# EasyEDA Pro project ProPrj_baqu_PCB_kyubeom_2026-08-27.epro

# Schematic Schematic1

## Sheets
1 Power, Connector: Board Name: Board1; Create Date: 2026-07-14; Page Name: P1; Project Name: baqu_PCB_kyubeom; Schematic Name: Schematic1; Update Date: 2026-07-14; Company: EasyEDA.com; Page Size: A4; Version: V1.0
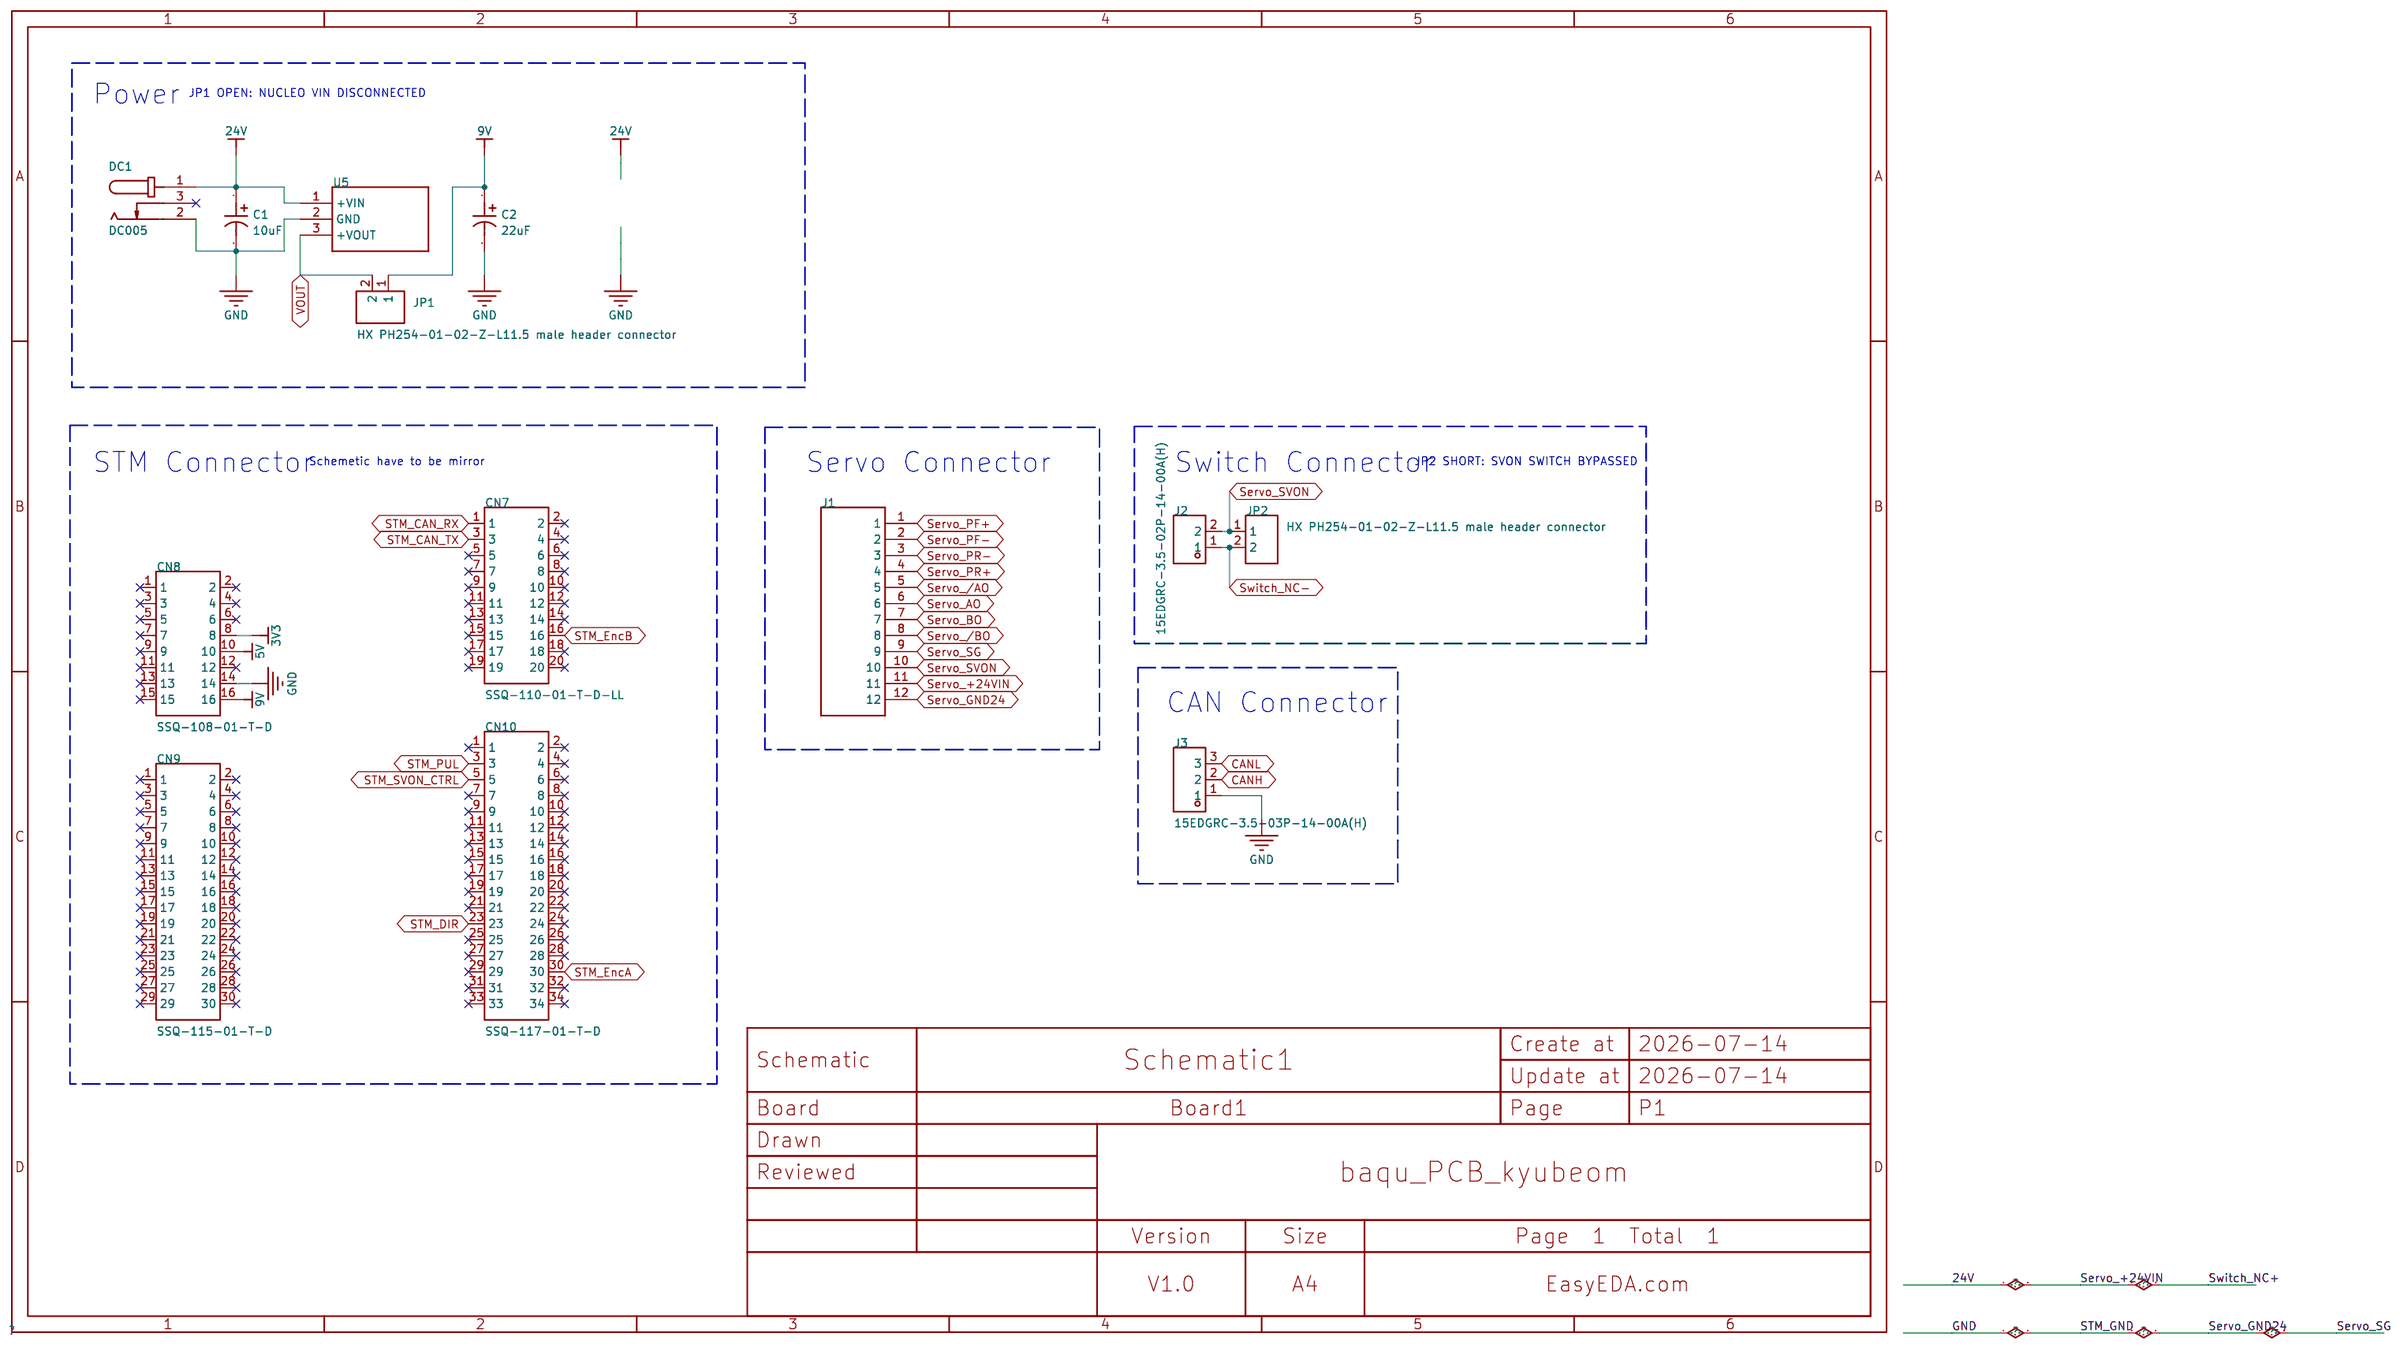
[diagram p0: Power, Connector]
2 IC: Create Date: 2026-08-25; Page Name: P3; Update Date: 2026-08-25
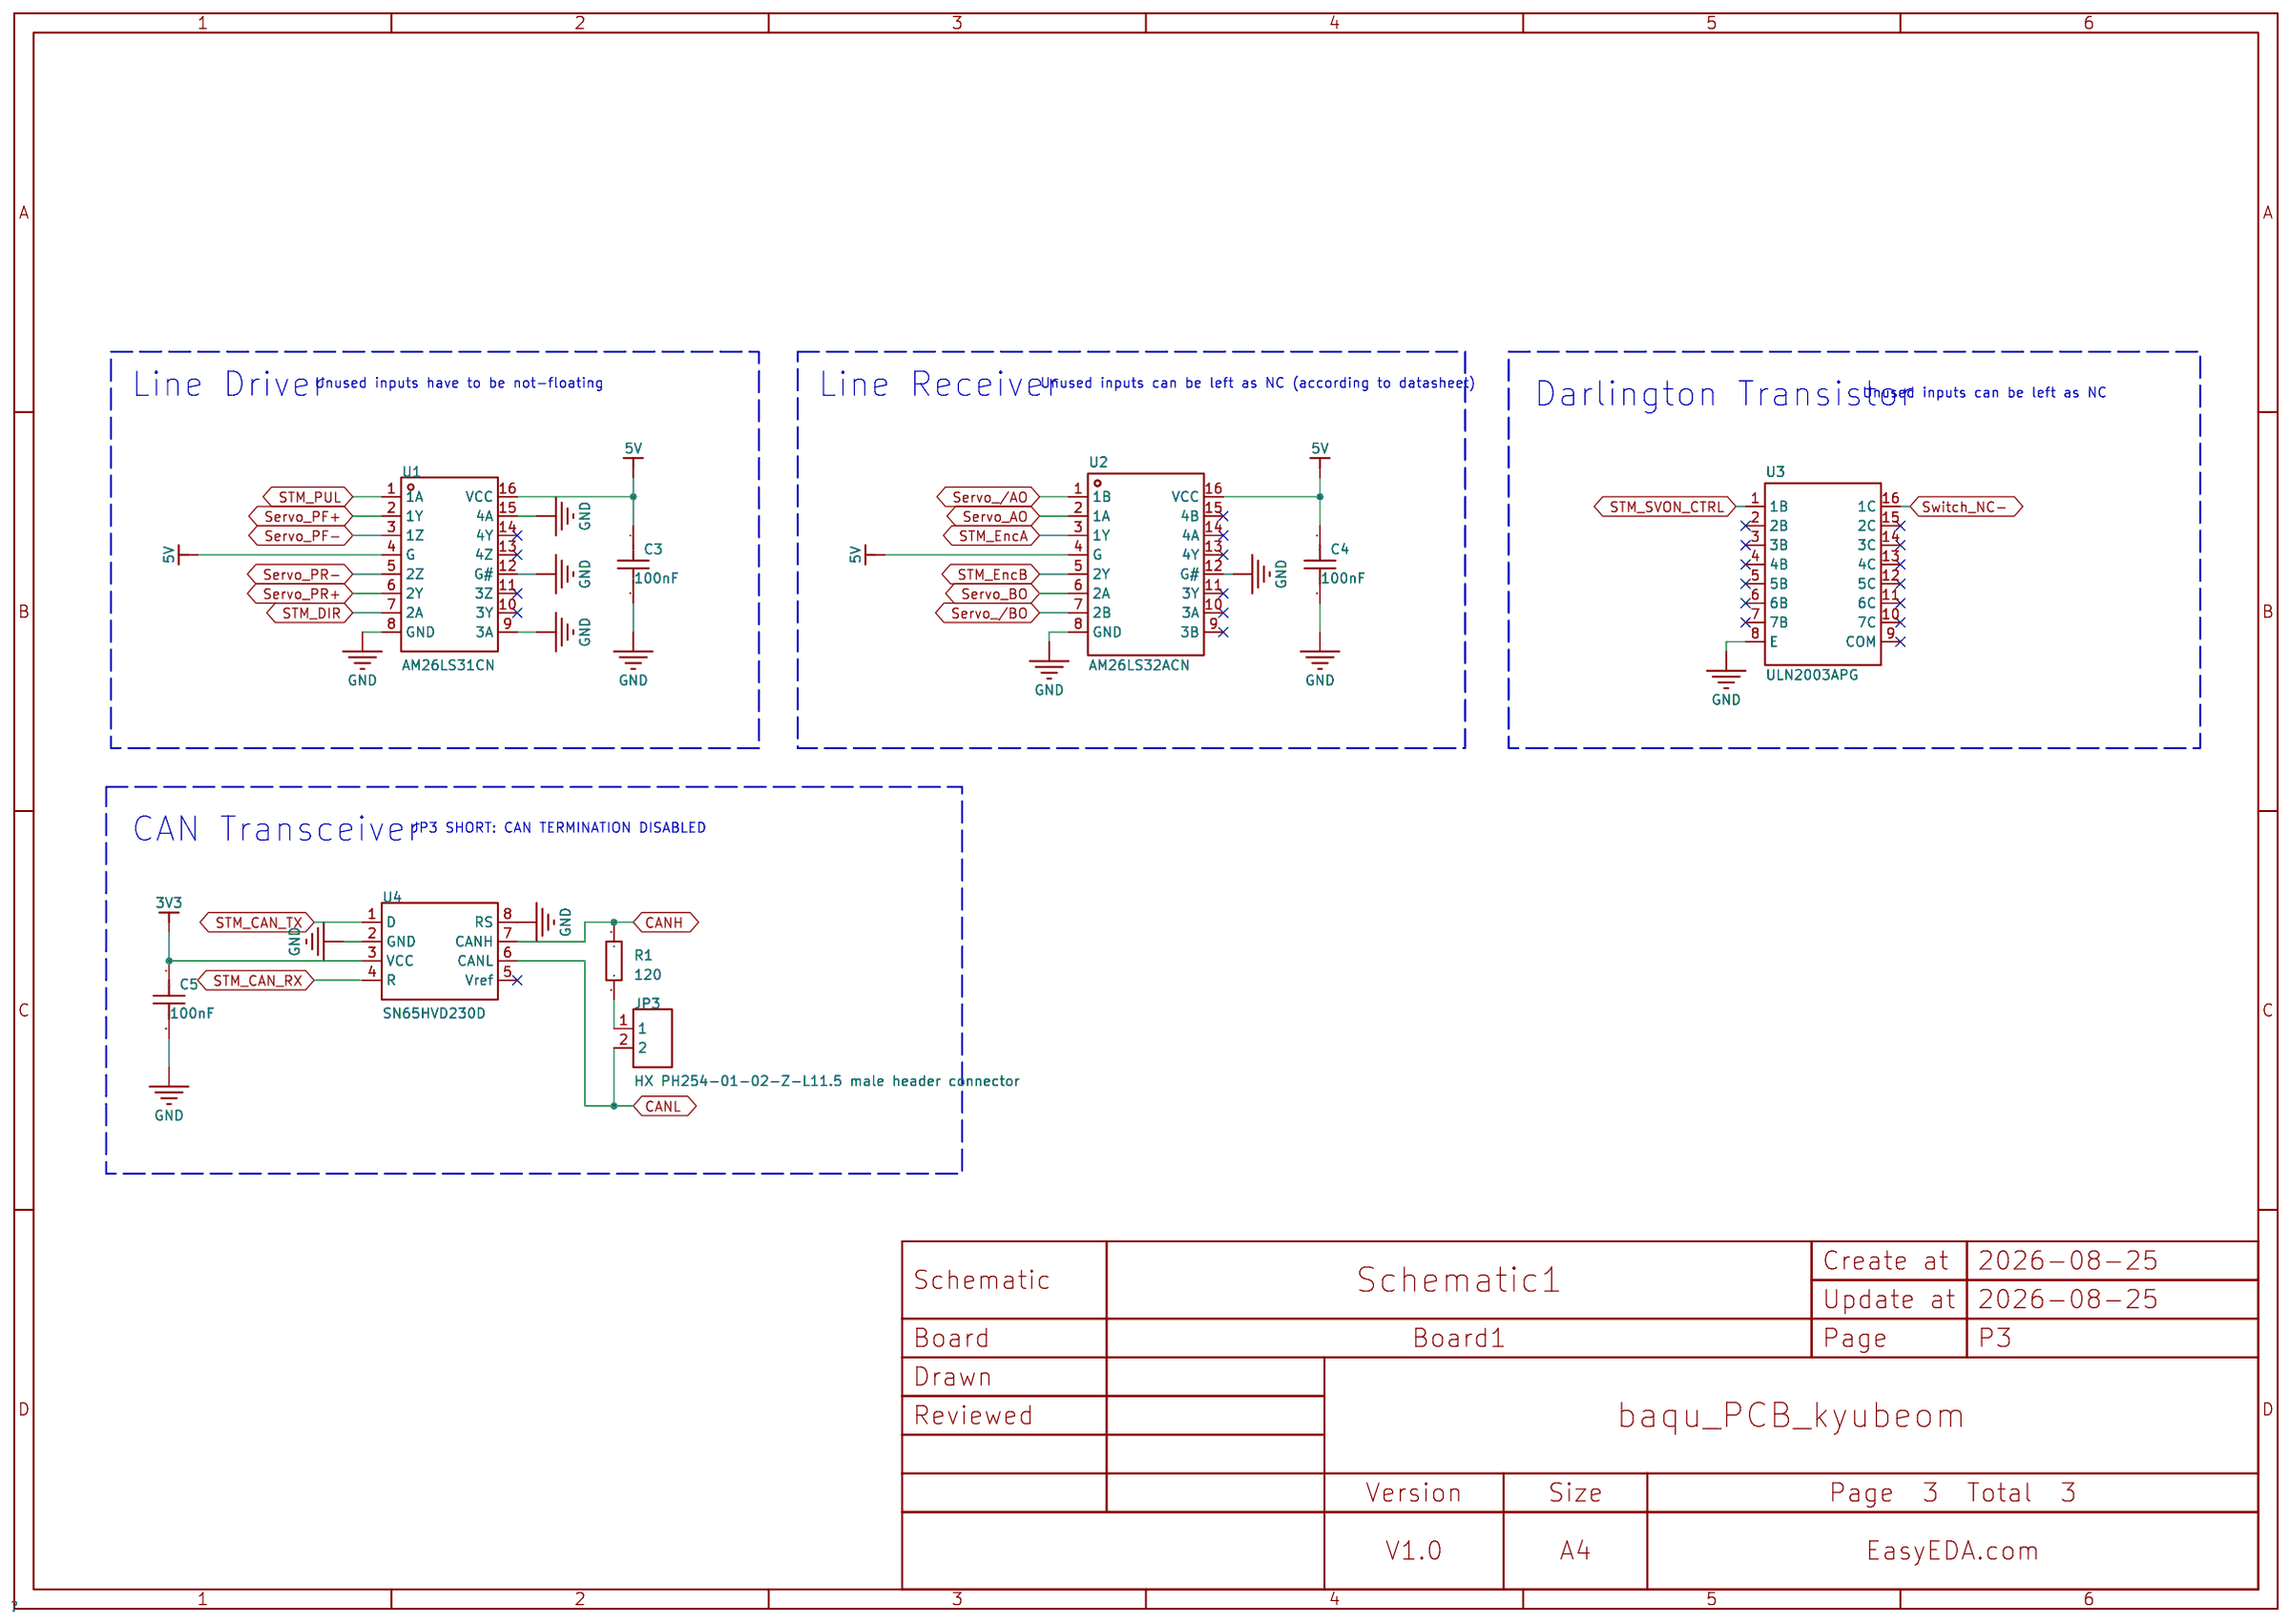
[diagram p1: IC]

## Parts
sheet IC
C3  100nF  [C0805]
C4  100nF  [C0805]
C5  100nF  [C0805]
JP3  HX PH254-01-02-Z-L11.5 male header connector  [HDR-TH_2P-P2.54-V-M]
R1  120  [R0805]
U1  AM26LS31CN  [DIP-16_L20.4-W5.8-P2.54-LS7.6-BL]
U2  AM26LS32ACN  [DIP-16_L20.0-W6.4-P2.54-LS7.6-BL]
U3  ULN2003APG  [DIP-16_L19.2-W6.6-P2.54-LS7.6-BL]
U4  SN65HVD230D  [SOIC-8_L4.9-W3.9-P1.27-LS6.0-BL]
sheet Power, Connector
C1  10uF  [CAP-TH_BD5.0-P2.00-D0.5-FD]
C2  22uF  [CAP-TH_BD5.0-P2.00-D0.5-FD]
CN7  SSQ-110-01-T-D-LL  [CONN-TH_SSQ-110-03-G-D]
CN8  SSQ-108-01-T-D  [HDR-TH_16P-P2.54_SSQ-108-01-G-D]
CN9  SSQ-115-01-T-D  [HDR-TH_30P-P2.54_SSQ-115-03-G-D]
CN10  SSQ-117-01-T-D  [HDR-TH_34P-P2.54_SSQ-117-01-T-D]
DC1  DC005  [DC-IN-TH_DC005]
J1  -  [530481210]
J2  15EDGRC-3.5-02P-14-00A(H)  [CONN-TH_2P-P3.50_DEGSON_15EDGRC-3.5-02P-14-00A]
J3  15EDGRC-3.5-03P-14-00A(H)  [CONN-TH_3P-P3.50_15EDGRC-3.5-03P]
JP1  HX PH254-01-02-Z-L11.5 male header connector  [HDR-TH_2P-P2.54-V-M]
JP2  HX PH254-01-02-Z-L11.5 male header connector  [HDR-TH_2P-P2.54-V-M]
U5  -  [N78091C]

## Library data of the parts
C3-C5 = CAP_0805: Supplier Footprint: 0805
JP1-JP3 = HX PH254-01-02-Z-L11.5 male header connector: Pin Structure:1x2P Pitch:2.54mm Circluar Pins/Square Pins:Pin Header Mounting Type:Through Hole Number of Rows:1 Number of Pins:2P Current Rating:3A Voltage Rating (Max):1kV Length of Mating Pin:6mm Insulation Height:2.5mm Length of End Connection Pin:3mm; LCSC Part Name: 1x2P 间距:2.54mm 方针 直插; Supplier Part: C52016390; Manufacturer: hanxia(韩下); Supplier Footprint: 插件,P=2.54mm; JLCPCB Part Class: Extended Part; Datasheet: https://item.szlcsc.com/datasheet/HX%2520PH254-01-02-Z-L11.5%2520male%2520header%2520connector/54760435.html; Supplier: LCSC; Pin Structure: 1x2P; Pitch: 2.54mm; Circluar Pins/Square Pins: Pin Header; Mounting Type: Through Hole; Number of Rows: 1; Number of Pins: 2P; Current Rating: 3A; Voltage Rating (Max): 1kV; Length of Mating Pin: 6mm; Insulation Height: 2.5mm; Length of End Connection Pin: 3mm; Contact Material: Brass; Contact Plating: Gold; Operating Temperature: -40℃~+105℃
R1 = Res_0805: Supplier Footprint: 0805
U1 = AM26LS31CN: Type:Driver Number of Drivers:4 Number of Receivers:0 Voltage - Supply:4.75V~5.25V Voltage - Supply:4.75V~5.25V ESD Protect:±2kV ESD Protect:±2kV Operating Temperature:0℃~+70℃ Operating Temperature:0℃~+70℃ Quiescent Supply Current:80mA Features:Enable shu; LCSC Part Name: AM26LS31x 四重差分线驱动器; Supplier Part: C29911; Manufacturer: TI(德州仪器); Supplier Footprint: DIP-16; JLCPCB Part Class: Extended Part; Datasheet: https://www.ti.com/cn/lit/ds/symlink/am26ls31.pdf; Supplier: LCSC; Type: Driver; Number of Drivers: 4; Number of Receivers: 0; Voltage - Supply: 4.75V~5.25V; ESD Protect: ±2kV; Operating Temperature: 0℃~+70℃; Quiescent Supply Current: 80mA; Features: Enable shutdown；Overcurrent Protection
U2 = AM26LS32ACN: Type:Receiver Number of Drivers:0 Number of Receivers:4 Voltage - Supply:4.75V~5.25V Voltage - Supply:4.75V~5.25V Data Rate:- Data Rate:- Number of Nodes:- ESD Protect:- ESD Protect:- Operating Temperature:0℃~+70℃ Operating Temperature:0℃~+70℃ Quiescent S; LCSC Part Name: 四路差分线接收器; Supplier Part: C29912; Manufacturer: TI(德州仪器); Supplier Footprint: DIP-16; JLCPCB Part Class: Extended Part; Datasheet: https://www.ti.com/cn/lit/gpn/am26ls32ac; Supplier: LCSC; Type: Receiver; Number of Drivers: 0; Number of Receivers: 4; Voltage - Supply: 4.75V~5.25V; Operating Temperature: 0℃~+70℃; Quiescent Supply Current: 52mA
U3 = ULN2003APG: number of channels:Seven channels Collector - Emitter Voltage VCEO:- Current - Collector(Ic):500mA Voltage - Input(Max):30V Operating Temperature:- Operating Temperature:- Output Leakage Current(Icex):50uA Vce Saturation(VCE(sat)):1.6V Input Current(on):0; LCSC Part Name: 停产 ULN2003APG; Supplier Part: C5251; Manufacturer: TOSHIBA(东芝); Supplier Footprint: DIP-16; JLCPCB Part Class: Extended Part; Datasheet: https://item.szlcsc.com/datasheet/ULN2003APG/5672.html; Supplier: LCSC; number of channels: Seven channels; Current - Collector(Ic): 500mA; Voltage - Input(Max): 30V; Output Leakage Current(Icex): 50uA; Vce Saturation(VCE(sat)): 1.6V; Input Current(on): 0.4mA; Voltage - Forward(Vf): 2V; Reverse Leakage Current (Ir): 50uA; Input Capacitiance(Ci): 15pF; Type: BJT
U4 = SN65HVD230D: Type:CAN Transceiver Data Rate:1Mbps Voltage - Supply:3V~3.6V Voltage - Supply:3V~3.6V Current - Supply:17mA Operating Temperature:-40℃~+85℃ Operating Temperature:-40℃~+85℃ Number of Channels:1 Quiescent Supply Current:370uA Features:Wake-up function；Hot-; LCSC Part Name: SN65HVD230, SN65HVD231, SN65HVD232 3.3V CAN总线收发器 停产; Supplier Part: C1543812; Manufacturer: TI(德州仪器); Supplier Footprint: SOIC-8; JLCPCB Part Class: Extended Part; Datasheet: https://www.ti.com/cn/lit/ds/symlink/sn65hvd230.pdf; Supplier: LCSC; Type: CAN Transceiver; Data Rate: 1Mbps; Voltage - Supply: 3V~3.6V; Current - Supply: 17mA; Operating Temperature: -40℃~+85℃; Number of Channels: 1; Quiescent Supply Current: 370uA; Features: Wake-up function；Hot-swap protection；Thermal shutdown protection；ESD protection；Low-power mode；Bus fault protection
C1 C2 = 50V10uF CD288: Capacitance:10uF Tolerance:±20% Tolerance:±20% Voltage Rating:50V Pin Spacing:2mm Diameter:5mm Height - Seated (Max):11mm Operating Temperature:-40℃~+105℃ Operating Temperature:-40℃~+105℃; LCSC Part Name: 10uF ±20% 50V; Supplier Part: C2960372; Manufacturer: HRK(鸿瑞凯电子); Supplier Footprint: 插件,D5xL11mm; JLCPCB Part Class: Extended Part; Supplier: LCSC; Tolerance: ±20%; Voltage Rating: 50V; Pin Spacing: 2mm; Diameter: 5mm; Height - Seated (Max): 11mm; Operating Temperature: -40℃~+105℃
CN7 = SSQ-110-01-T-D-LL: Pitch:2.54mm Row Spacing:2.54mm Mounting Type:Through Hole Number of Rows:2 Number of Positions:20P Voltage Rating (Max):- Insulation Height:8.51mm Contact Plating:Tin Operating Temperature:-55℃~+105℃ Operating Temperature:-55℃~+105℃; LCSC Part Name: 间距:2.54mm 直插; Supplier Part: C5930738; Manufacturer: SAMTEC; Supplier Footprint: 插件,P=2.54mm; JLCPCB Part Class: Extended Part; Datasheet: https://item.szlcsc.com/datasheet/SSQ-110-01-T-D-LL/6868091.html; Supplier: LCSC; Pitch: 2.54mm; Row Spacing: 2.54mm; Mounting Type: Through Hole; Number of Rows: 2; Number of Positions: 20P; Insulation Height: 8.51mm; Contact Plating: Tin; Operating Temperature: -55℃~+105℃
CN8 = SSQ-108-01-T-D: Pitch:2.54mm Row Spacing:2.54mm Mounting Type:Through Hole Number of Rows:2 Number of Positions:16P Voltage Rating (Max):- Insulation Height:8.51mm Contact Plating:Tin Operating Temperature:-55℃~+105℃ Operating Temperature:-55℃~+105℃; LCSC Part Name: 间距:2.54mm 直插; Supplier Part: C5930694; Manufacturer: SAMTEC; Supplier Footprint: 插件,P=2.54mm; JLCPCB Part Class: Extended Part; Datasheet: https://item.szlcsc.com/datasheet/SSQ-108-01-T-D/6868047.html; Supplier: LCSC; Pitch: 2.54mm; Row Spacing: 2.54mm; Mounting Type: Through Hole; Number of Rows: 2; Number of Positions: 16P; Insulation Height: 8.51mm; Contact Plating: Tin; Operating Temperature: -55℃~+105℃
CN9 = SSQ-115-01-T-D: Pitch:2.54mm Row Spacing:2.54mm Mounting Type:Through Hole Number of Rows:2 Number of Positions:30P Voltage Rating (Max):- Insulation Height:8.51mm Contact Plating:Tin Operating Temperature:-55℃~+105℃ Operating Temperature:-55℃~+105℃; LCSC Part Name: 间距:2.54mm 直插; Supplier Part: C6496536; Manufacturer: SAMTEC; Supplier Footprint: 插件,P=2.54mm; JLCPCB Part Class: Extended Part; Datasheet: https://item.szlcsc.com/datasheet/SSQ-115-01-T-D/7449721.html; Supplier: LCSC; Pitch: 2.54mm; Row Spacing: 2.54mm; Mounting Type: Through Hole; Number of Rows: 2; Number of Positions: 30P; Insulation Height: 8.51mm; Contact Plating: Tin; Operating Temperature: -55℃~+105℃
CN10 = SSQ-117-01-T-D: Pitch:2.54mm Row Spacing:2.54mm Circular Hole / Square Hole:Square Hole Mounting Type:Through Hole Number of Rows:2 Number of Positions:34P Current Rating:4.7A Voltage Rating (Max):655V Holes Direction:Top Insulation Height:8.51mm Contact Plating:Tin Oper; LCSC Part Name: 间距:2.54mm 直插; Supplier Part: C5760723; Manufacturer: SAMTEC; Supplier Footprint: 插件,P=2.54mm; JLCPCB Part Class: Extended Part; Datasheet: https://item.szlcsc.com/datasheet/SSQ-117-01-T-D/6687000.html; Supplier: LCSC; Pitch: 2.54mm; Row Spacing: 2.54mm; Circular Hole / Square Hole: Square Hole; Mounting Type: Through Hole; Number of Rows: 2; Number of Positions: 34P; Current Rating: 4.7A; Voltage Rating (Max): 655V; Holes Direction: Top; Insulation Height: 8.51mm; Contact Plating: Tin; Operating Temperature: -55℃~+105℃
DC1 = DC005: Connector Type:DC Power Jack Mounting Type:Right Angle Inside Contact Diameter:2mm Outside Contact Diameter:6.3mm Current Rating:500mA Voltage Rating (Max):12V Operating Temperature:-30℃~+70℃ Operating Temperature:-30℃~+70℃; LCSC Part Name: DC005-2.0 黑（铁）; Supplier Part: C431533; Manufacturer: SHOU HAN(首韩); Supplier Footprint: 插件; JLCPCB Part Class: Extended Part; Datasheet: https://item.szlcsc.com/datasheet/DC005/427890.html; Supplier: LCSC; Connector Type: DC Power Jack; Mounting Type: Right Angle; Inside Contact Diameter: 2mm; Outside Contact Diameter: 6.3mm; Current Rating: 500mA; Voltage Rating (Max): 12V; Operating Temperature: -30℃~+70℃
J1 = 53048-1210
J2 = 15EDGRC-3.5-02P-14-00A(H): Connector Type:Board Side/Socket - Closed Termination Style:Hinged (Snap On) Number of Positions or Pins:1x2P Pitch:3.5mm Color:Green Mounting Type:Right-Angle Number of Pins:2P Number of Rows:1 Number of PINs Per Row:2 Current Rating:7A Voltage Rating (M; LCSC Part Name: 卡扣固定 1x2P 3.5mm 排数:1 每排P数:2; Supplier Part: C5160225; Manufacturer: DEGSON(高正/高松); Supplier Footprint: 插件,P=3.5mm; JLCPCB Part Class: Extended Part; Datasheet: https://item.szlcsc.com/datasheet/15EDGRC-3.5-02P-14-00A(H)/5805069.html; Supplier: LCSC; Connector Type: Board Side/Socket - Closed; Termination Style: Hinged (Snap On); Number of Positions or Pins: 1x2P; Pitch: 3.5mm; Color: Green; Mounting Type: Right-Angle; Number of Pins: 2P; Number of Rows: 1; Number of PINs Per Row: 2; Current Rating: 7A; Voltage Rating (Max): 250V; Operating Temperature: -40℃~+105℃
J3 = 15EDGRC-3.5-03P-14-00A(H): Connector Type:Board Side/Socket - Closed Number of Positions or Pins:1x3P Pitch:3.5mm Color:Green Mounting Type:Right-Angle Number of Pins:3P Number of Rows:1 Number of PINs Per Row:3 Current Rating:7A Voltage Rating (Max):250V Operating Temperature:-40℃; LCSC Part Name: 1x3P 3.5mm 排数:1 每排P数:3; Supplier Part: C5160226; Manufacturer: DEGSON(高正/高松); Supplier Footprint: 插件,P=3.5mm; JLCPCB Part Class: Extended Part; Datasheet: https://item.szlcsc.com/datasheet/15EDGRC-3.5-03P-14-00A(H)/5805070.html; Supplier: LCSC; Connector Type: Board Side/Socket - Closed; Number of Positions or Pins: 1x3P; Pitch: 3.5mm; Color: Green; Mounting Type: Right-Angle; Number of Pins: 3P; Number of Rows: 1; Number of PINs Per Row: 3; Current Rating: 7A; Voltage Rating (Max): 250V; Operating Temperature: -40℃~+105℃
U5 = N7809-1C

## Nets
3V3: C5.1 CN8.8 U4.3(VCC)
5V: C3.1 C4.1 CN8.10 U1.4(G) U1.16(VCC) U2.4(G) U2.16(VCC)
9V: C2.1 CN8.16 JP1.1
24V: C1.1 DC1.1 J1.11 U5.1(+VIN)
GND: C1.2 C2.2 C3.2 C4.2 C5.2 CN8.14 DC1.2 J1.9 J1.12 J3.1 U1.8(GND) U1.9(3A) U1.12(G#) U1.15(4A) U2.8(GND) U2.12(G#) U3.8(E) U4.2(GND) U4.8(RS) U5.2(GND)
CANH: J3.2 R1.1 U4.7(CANH)
CANL: J3.3 JP3.2 U4.6(CANL)
Servo_/AO: J1.5 U2.1(1B)
Servo_/BO: J1.8 U2.7(2B)
Servo_AO: J1.6 U2.2(1A)
Servo_BO: J1.7 U2.6(2A)
Servo_PF+: J1.1 U1.2(1Y)
Servo_PF-: J1.2 U1.3(1Z)
Servo_PR+: J1.4 U1.6(2Y)
Servo_PR-: J1.3 U1.5(2Z)
Servo_SVON: J1.10 J2.2 JP2.1
STM_CAN_RX: CN7.1 U4.4(R)
STM_CAN_TX: CN7.3 U4.1(D)
STM_DIR: CN10.23 U1.7(2A)
STM_EncA: CN10.30 U2.3(1Y)
STM_EncB: CN7.16 U2.5(2Y)
STM_PUL: CN10.3 U1.1(1A)
STM_SVON_CTRL: CN10.5 U3.1(1B)
Switch_NC-: J2.1 JP2.2 U3.16(1C)
VOUT: JP1.2 U5.3(+VOUT)
$4N50: JP3.1 R1.2

Not connected (* = marked no-connect by the designer): CN7 2* 4* 5* 6* 7* 8* 9* 10* 11* 12* 13* 14* 15* 17* 18* 19* 20*; CN8 1* 2* 3* 4* 5* 6* 7* 9* 11* 12* 13* 15*; CN9 1* 2* 3* 4* 5* 6* 7* 8* 9* 10* 11* 12* 13* 14* 15* 16* 17* 18* 19* 20* 21* 22* 23* 24* 25* 26* 27* 28* 29* 30*; CN10 1* 2* 4* 6* 7* 8* 9* 10* 11* 12* 13* 14* 15* 16* 17* 18* 19* 20* 21* 22* 24* 25* 26* 27* 28* 29* 31* 32* 33* 34*; DC1 3*; U1 10(3Y)* 11(3Z)* 13(4Z)* 14(4Y)*; U2 9(3B)* 10(3A)* 11(3Y)* 13(4Y)* 14(4A)* 15(4B)*; U3 2(2B)* 3(3B)* 4(4B)* 5(5B)* 6(6B)* 7(7B)* 9(COM)* 10(7C)* 11(6C)* 12(5C)* 13(4C)* 14(3C)* 15(2C)*; U4 5(Vref)*

## Notes on the sheets
sheet 1
- Power
- JP1 OPEN: NUCLEO VIN DISCONNECTED
- Schemetic have to be mirror
- JP2 SHORT: SVON SWITCH BYPASSED
- STM Connector
- Servo Connector
- Switch Connector
- CAN Connector
sheet 2
- Line Driver
- Unused inputs have to be not-floating
- Line Receiver
- Unused inputs can be left as NC (according to datasheet)
- Darlington Transistor
- Unused inputs can be left as NC
- CAN Transceiver
- JP3 SHORT: CAN TERMINATION DISABLED

# Board PCB1
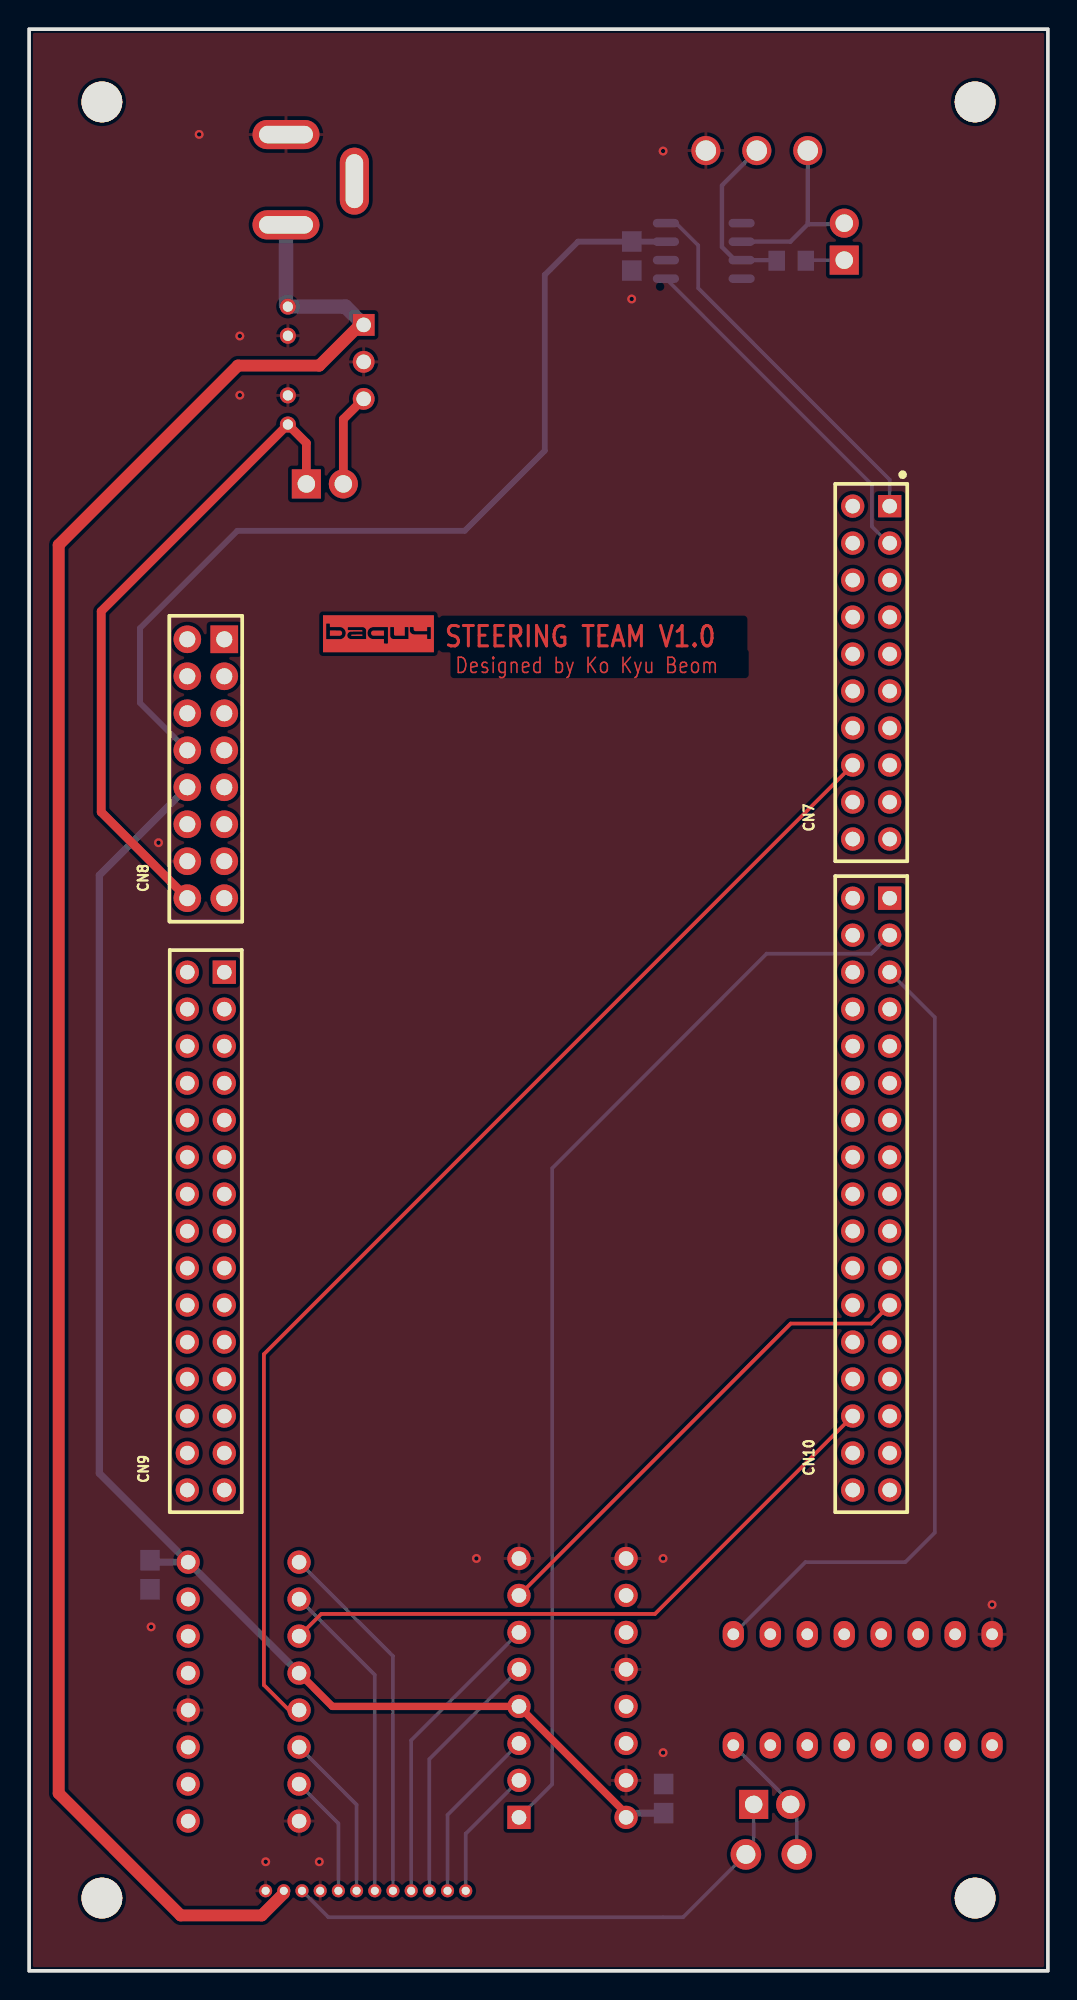
[diagram p2: board, top side]
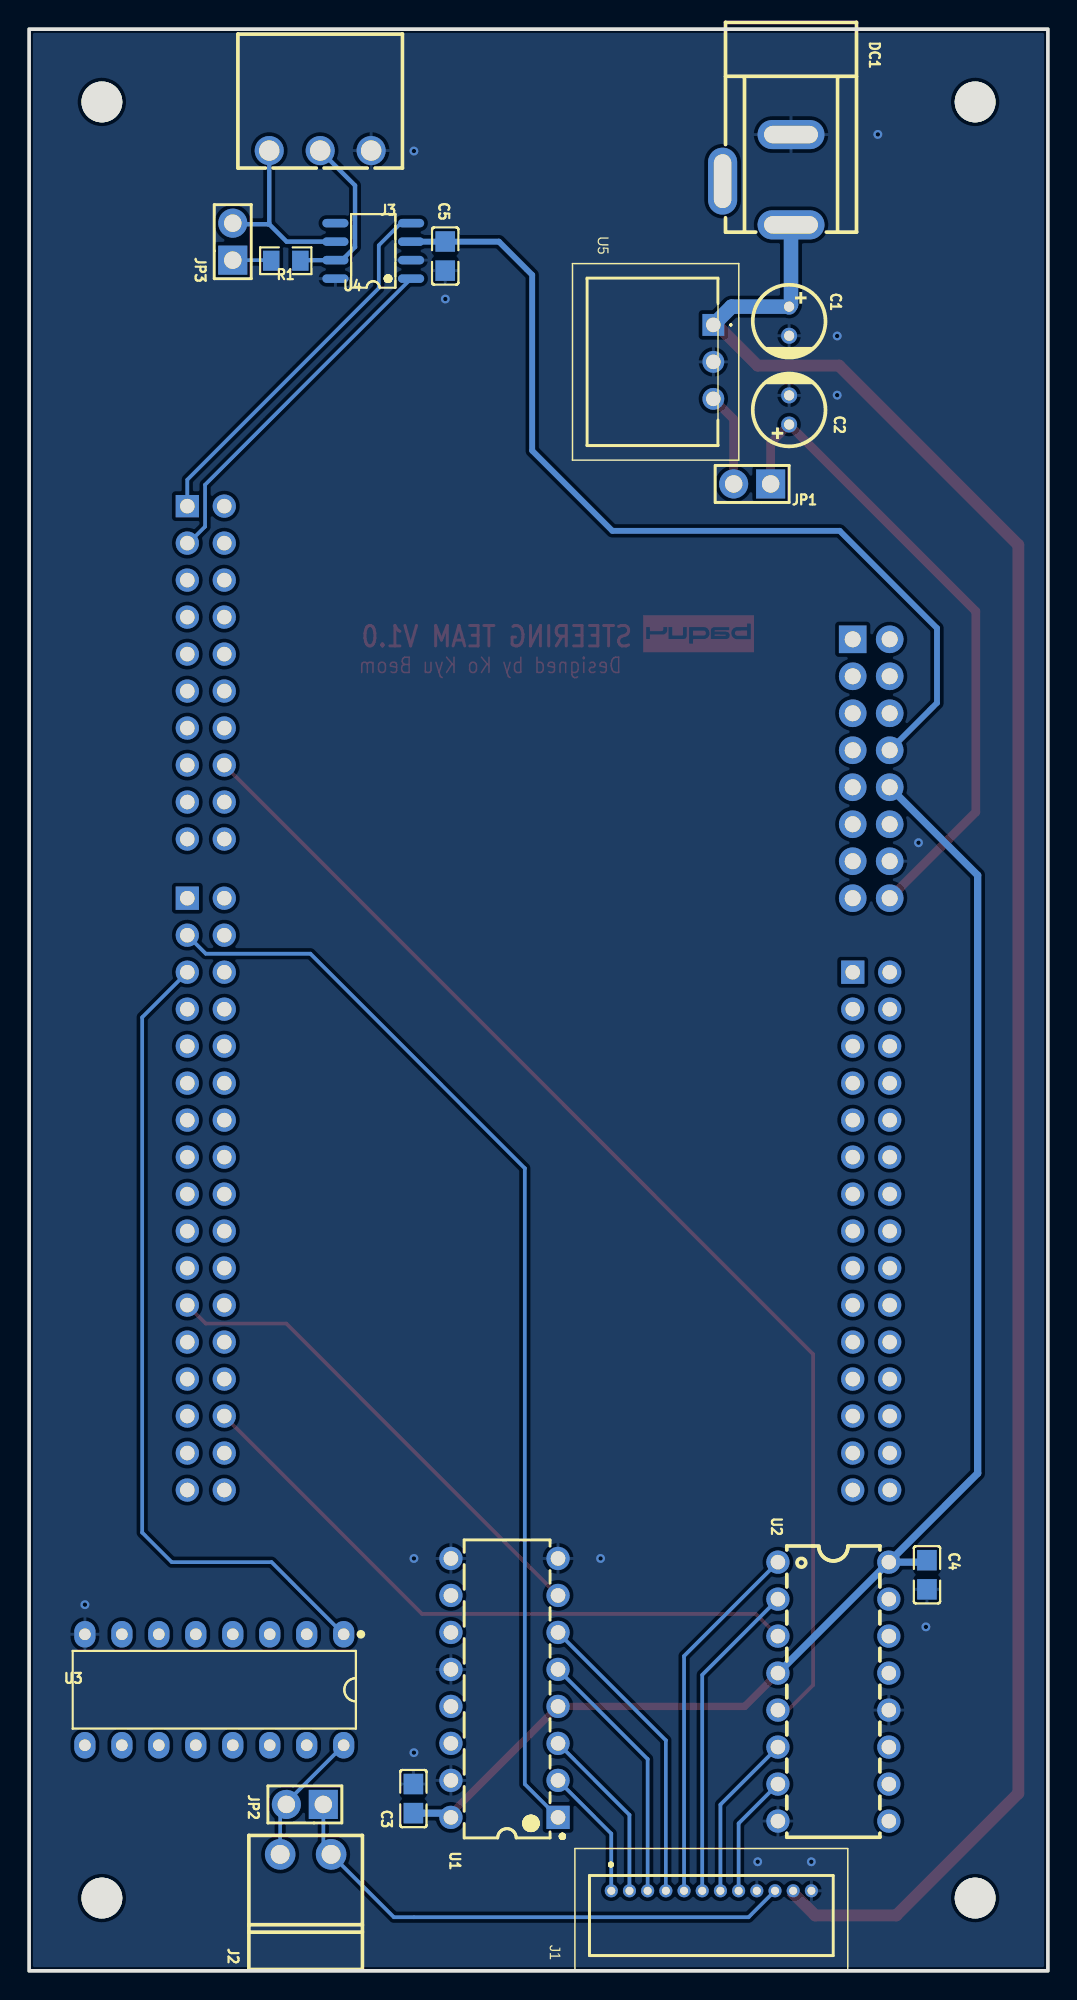
[diagram p3: board, bottom side, seen from below]

Outline 70 x 133.34 mm; copper layers: Top Layer, Bottom Layer. Coordinates in mm from the lower left corner of the outline.
Outline path: rectangle 0,133.34 70,0
Stack: Top Layer 0.035mm / Dielectric1 1.51mm FR4 er 4.5 / Bottom Layer 0.035mm

## Design rules (mm)
spacing copperThickness1oz (default): track to track 0.102, other pairs 0.152 to 0.3
spacing copperThickness2oz: track to track 0.203, other pairs 0.152 to 0.3
track width copperThickness1oz: min 0.127, default 0.254, max 2.54
track width copperThickness2oz: min 0.203, default 0.254, max 2.54
track width Signal_025 (default): min 0.127, default 0.254, max 2.54
track width CAN_030: min 0.127, default 0.3, max 2.54
track width PWR_24V_100: min 0.127, default 1, max 2.54
track width PWR_3V3_040: min 0.127, default 0.4, max 2.54
track width PWR_5V_050: min 0.127, default 0.5, max 2.54
track width PWR_9V_060: min 0.127, default 0.6, max 2.54
differential pair differentialPair (default): width min 0.127, default 0.254, max 2.54; gap min 0.152, default 0.152
net 3V3 uses PWR_3V3_040
net 5V uses PWR_5V_050
net 9V uses PWR_9V_060
net 24V uses PWR_24V_100
net CANH uses CAN_030
net CANL uses CAN_030
net GND uses copperRegion

## Placement (name value [footprint] x y rotation side)
C1  10uF  [CAP-TH_BD5.0-P2.00-D0.5-FD]  17.78 113.28 270 bottom
C2  22uF  [CAP-TH_BD5.0-P2.00-D0.5-FD]  17.78 107.19 90 bottom
C3  100nF  [C0805]  43.6 11.83 90 bottom
C4  100nF  [C0805]  8.31 27.2 270 bottom
C5  100nF  [C0805]  41.41 117.76 270 bottom
CN7  SSQ-110-01-T-D-LL  [CONN-TH_SSQ-110-03-G-D]  57.86 89.15 90 top
CN8  SSQ-108-01-T-D  [HDR-TH_16P-P2.54_SSQ-108-01-G-D]  12.14 82.55 90 top
CN9  SSQ-115-01-T-D  [HDR-TH_30P-P2.54_SSQ-115-03-G-D]  12.14 50.8 90 top
CN10  SSQ-117-01-T-D  [HDR-TH_34P-P2.54_SSQ-117-01-T-D]  57.86 53.34 90 top
DC1  DC005  [DC-IN-TH_DC005]  20 123 270 bottom
J1  53048-1210  [530481210]  30 5.5 0 bottom
J2  15EDGRC-3.5-02P-14-00A(H)  [CONN-TH_2P-P3.50_DEGSON_15EDGRC-3.5-02P-14-00A]  51 8 180 bottom
J3  15EDGRC-3.5-03P-14-00A(H)  [CONN-TH_3P-P3.50_15EDGRC-3.5-03P]  50 125 0 bottom
JP1  HX PH254-01-02-Z-L11.5 male header connector  [HDR-TH_2P-P2.54-V-M]  20.32 102.11 0 bottom
JP2  HX PH254-01-02-Z-L11.5 male header connector  [HDR-TH_2P-P2.54-V-M]  51.05 11.43 0 bottom
JP3  HX PH254-01-02-Z-L11.5 male header connector  [HDR-TH_2P-P2.54-V-M]  56.01 118.75 90 bottom
NOREF  -  [Pad_e78]  65 128.34 0 top
NOREF#2  -  [Pad_e80]  65 5 0 top
NOREF#3  -  [Pad_e79]  5 5 0 top
NOREF#4  -  [Pad_e77]  5 128.34 0 top
R1  120  [R0805]  52.37 117.44 0 bottom
U1  AM26LS31CN  [DIP-16_L20.4-W5.8-P2.54-LS7.6-BL]  37.34 19.43 90 bottom
U2  AM26LS32ACN  [DIP-16_L20.0-W6.4-P2.54-LS7.6-BL]  14.74 19.18 270 bottom
U3  ULN2003APG  [DIP-16_L19.2-W6.6-P2.54-LS7.6-BL]  57.28 19.3 0 bottom
U4  SN65HVD230D  [SOIC-8_L4.9-W3.9-P1.27-LS6.0-BL]  46.35 118.11 90 bottom
U5  N7809-1C  [N78091C]  22.99 113.03 270 bottom

## Footprints (pads in the part's own frame, mm; a bottom-side part is the same pattern mirrored in y, then rotated)
530481210
  round 0.9 hole 0.55: 1(0,0) 2(-1.25,0) 3(-2.5,0) 4(-3.75,0) 5(-5,0) 6(-6.25,0) 7(-7.5,0) 8(-8.75,0) 9(-10,0) 10(-11.25,0) 11(-12.5,0) 12(-13.75,0)
C0805
  rect 1.41x1.35 smd: 1(-1,0) 2(1,0)
CAP-TH_BD5.0-P2.00-D0.5-FD
  round 1.1 hole 0.7: 1(-1,0) 2(1,0)
CONN-TH_2P-P3.50_DEGSON_15EDGRC-3.5-02P-14-00A
  round 2.1 hole 1.3: 1(-1.75,0) 2(1.75,0)
CONN-TH_3P-P3.50_15EDGRC-3.5-03P
  round 2 hole 1.4: 1(-3.5,0) 2(0,0) 3(3.5,0)
CONN-TH_SSQ-110-03-G-D
  rect 1.53x1.6 hole 1: 1(11.43,-1.27)
  round 1.6 hole 1: 2(11.43,1.27) 3(8.89,-1.27) 4(8.89,1.27) 5(6.35,-1.27) 6(6.35,1.27) 7(3.81,-1.27) 8(3.81,1.27) 9(1.27,-1.27) 10(1.27,1.27) 11(-1.27,-1.27) 12(-1.27,1.27) 13(-3.81,-1.27) 14(-3.81,1.27) 15(-6.35,-1.27) 16(-6.35,1.27) 17(-8.89,-1.27) 18(-8.89,1.27) 19(-11.43,-1.27) 20(-11.43,1.27)
DC-IN-TH_DC005
  oval 2x4.6 hole 1.2x3.7: 1(3.1,2.35) 2(-3.1,2.35)
  oval 4.6x2 hole 3.7x1.2: 3(0.1,-2.35)
DIP-16_L19.2-W6.6-P2.54-LS7.6-BL
  oval 1.46x1.825 hole 0.8: 1(-8.89,-3.81) 2(-6.35,-3.81) 3(-3.81,-3.81) 4(-1.27,-3.81) 5(1.27,-3.81) 6(3.81,-3.81) 7(6.35,-3.81) 8(8.89,-3.81) 9(8.89,3.81) 10(6.35,3.81) 11(3.81,3.81) 12(1.27,3.81) 13(-1.27,3.81) 14(-3.81,3.81) 15(-6.35,3.81) 16(-8.89,3.81)
DIP-16_L20.0-W6.4-P2.54-LS7.6-BL
  round 1.6 hole 1: 1(-8.89,-3.81) 2(-6.35,-3.81) 3(-3.81,-3.81) 4(-1.27,-3.81) 5(1.27,-3.81) 6(3.81,-3.81) 7(6.35,-3.81) 8(8.89,-3.81) 9(8.89,3.81) 10(6.35,3.81) 11(3.81,3.81) 12(1.27,3.81) 13(-1.27,3.81) 14(-3.81,3.81) 15(-6.35,3.81) 16(-8.89,3.81)
DIP-16_L20.4-W5.8-P2.54-LS7.6-BL
  rect 1.6x1.6 hole 1: 1(-8.89,-3.68)
  round 1.6 hole 1: 2(-6.35,-3.68) 3(-3.81,-3.68) 4(-1.27,-3.68) 5(1.27,-3.68) 6(3.81,-3.68) 7(6.35,-3.68) 8(8.89,-3.68) 9(8.89,3.68) 10(6.35,3.68) 11(3.81,3.68) 12(1.27,3.68) 13(-1.27,3.68) 14(-3.81,3.68) 15(-6.35,3.68) 16(-8.89,3.68)
HDR-TH_2P-P2.54-V-M
  rect 2x2 hole 1.2: 1(-1.27,0)
  round 2 hole 1.2: 2(1.27,0)
HDR-TH_16P-P2.54_SSQ-108-01-G-D
  rect 1.9x1.9 hole 1.1: 1(8.89,-1.27)
  round 1.9 hole 1.1: 2(8.89,1.27) 3(6.35,-1.27) 4(6.35,1.27) 5(3.81,-1.27) 6(3.81,1.27) 7(1.27,-1.27) 8(1.27,1.27) 9(-1.27,-1.27) 10(-1.27,1.27) 11(-3.81,-1.27) 12(-3.81,1.27) 13(-6.35,-1.27) 14(-6.35,1.27) 15(-8.89,-1.27) 16(-8.89,1.27)
HDR-TH_30P-P2.54_SSQ-115-03-G-D
  rect 1.6x1.6 hole 1: 1(17.78,-1.27)
  round 1.6 hole 1: 2(17.78,1.27) 3(15.24,-1.27) 4(15.24,1.27) 5(12.7,-1.27) 6(12.7,1.27) 7(10.16,-1.27) 8(10.16,1.27) 9(7.62,-1.27) 10(7.62,1.27) 11(5.08,-1.27) 12(5.08,1.27) 13(2.54,-1.27) 14(2.54,1.27) 15(0,-1.27) 16(0,1.27) 17(-2.54,-1.27) 18(-2.54,1.27) 19(-5.08,-1.27) 20(-5.08,1.27) 21(-7.62,-1.27) 22(-7.62,1.27) 23(-10.16,-1.27) 24(-10.16,1.27) 25(-12.7,-1.27) 26(-12.7,1.27) 27(-15.24,-1.27) 28(-15.24,1.27) 29(-17.78,-1.27) 30(-17.78,1.27)
HDR-TH_34P-P2.54_SSQ-117-01-T-D
  rect 1.6x1.6 hole 1: 1(20.32,-1.27)
  round 1.6 hole 1: 2(20.32,1.27) 3(17.78,-1.27) 4(17.78,1.27) 5(15.24,-1.27) 6(15.24,1.27) 7(12.7,-1.27) 8(12.7,1.27) 9(10.16,-1.27) 10(10.16,1.27) 11(7.62,-1.27) 12(7.62,1.27) 13(5.08,-1.27) 14(5.08,1.27) 15(2.54,-1.27) 16(2.54,1.27) 17(0,-1.27) 18(0,1.27) 19(-2.54,-1.27) 20(-2.54,1.27) 21(-5.08,-1.27) 22(-5.08,1.27) 23(-7.62,-1.27) 24(-7.62,1.27) 25(-10.16,-1.27) 26(-10.16,1.27) 27(-12.7,-1.27) 28(-12.7,1.27) 29(-15.24,-1.27) 30(-15.24,1.27) 31(-17.78,-1.27) 32(-17.78,1.27) 33(-20.32,-1.27) 34(-20.32,1.27)
N78091C
  rect 1.5x1.5 hole 1: 1(0,0)
  round 1.5 hole 1: 2(2.54,0) 3(5.08,0)
Pad_e77
  round 2.8 hole 2.8: 1(0,0)
Pad_e78
  round 2.8 hole 2.8: 2(0,0)
Pad_e79
  round 2.8 hole 2.8: 3(0,0)
Pad_e80
  round 2.8 hole 2.8: 4(0,0)
R0805
  rect 1.133x1.377 smd: 1(-1,0) 2(1,0)
SOIC-8_L4.9-W3.9-P1.27-LS6.0-BL
  oval 0.588x1.8 smd: 1(-1.905,-2.6) 2(-0.635,-2.6) 3(0.635,-2.6) 4(1.905,-2.6) 5(1.905,2.6) 6(0.635,2.6) 7(-0.635,2.6) 8(-1.905,2.6)

## Nets
As in the schematic.

Pads without a net: CN7 2 4 5 6 7 8 9 10 11 12 13 14 15 17 18 19 20; CN8 1 2 3 4 5 6 7 9 11 12 13 15; CN9 1 2 3 4 5 6 7 8 9 10 11 12 13 14 15 16 17 18 19 20 21 22 23 24 25 26 27 28 29 30; CN10 1 2 4 6 7 8 9 10 11 12 13 14 15 16 17 18 19 20 21 22 24 25 26 27 28 29 31 32 33 34; DC1 3; NOREF 2; NOREF#2 4; NOREF#3 3; NOREF#4 1; U1 10 11 13 14; U2 9 10 11 13 14 15; U3 2 3 4 5 6 7 9 10 11 12 13 14 15; U4 5

## Via types
v1: diameter 0.61, hole 0.305, Top Layer to Bottom Layer, 13 vias

## Routing (per net, layer and track width the routed paths; a pad name or vN(x,y) marks a point on that pad's centre or on a via; arc(x,y) is an arc through that point)
3V3: length 63.9
  Bottom Layer w0.4: U4.3 37.72,118.75 35.43,116.46 35.43,104.39 29.93,98.89 14.31,98.89 7.62,92.2 7.62,87.07 CN8.8
5V: length 101.1
  Top Layer w0.5: U2.4 20.84,18.16 U1.4 41.02,10.8 U1.16
  Bottom Layer w0.5: U1.16 41.31,10.83 C3.1 ; U2.16 4.83,34.17 4.83,75.24 CN8.10 ; U2.16 U2.4 ; U2.16 8.44,28.07 C4.1
9V: length 44.9
  Top Layer w0.6: CN8.16 4.95,79.58 4.95,93.36 C2.1 19.05,104.92 JP1.1
24V: length 144.1
  Top Layer w0.815: J1.11 17.5,5.32 15.99,3.81 10.41,3.81 2.03,12.19 2.03,97.92 14.35,110.24 19.94,110.24 22.73,113.03 U5.1
  Bottom Layer w0.997: DC1.1 17.65,114.41 C1.1 21.73,114.28 U5.1
GND:
  vias: v1(8.38,23.62) v1(8.89,77.47) v1(11.68,126.11) v1(14.48,112.27) v1(14.48,108.2) v1(16.26,7.49) v1(19.94,7.49) v1(30.73,28.32) v1(41.4,114.81) v1(43.56,124.97) v1(43.56,28.32) v1(43.56,14.99) v1(66.17,25.15)
CANH: length 11.8
  Bottom Layer w0.3: J3.2 47.6,122.6 47.6,118.38 48.5,117.47 51.33,117.47 R1.1
CANL: length 12.7
  Bottom Layer w0.3: 53.6,119.94 53.5,120.05 J3.3 ; 53.6,119.94 53.5,119.94 52.31,118.75 48.96,118.75 ; 53.6,119.94 55.94,119.94 JP3.2
SERVO_/AO: length 25.2
  Bottom Layer w0.254: 18.55,28.07 25,21.62 25,5.5
SERVO_/BO: length 8.4
  Bottom Layer w0.254: 21.25,5.5 21.25,10.13 18.55,12.83
SERVO_AO: length 22.2
  Bottom Layer w0.254: 18.55,25.53 23.75,20.33 23.75,5.5
SERVO_BO: length 11.5
  Bottom Layer w0.254: 18.55,15.37 22.5,11.42 22.5,5.5
SERVO_PF+: length 9.1
  Bottom Layer w0.254: 30,5.5 30,9.42 33.66,13.08
SERVO_PF-: length 12.2
  Bottom Layer w0.254: 33.66,15.62 28.75,10.71 28.75,5.5
SERVO_PR+: length 20.8
  Bottom Layer w0.254: 26.25,5.5 26.25,15.83 33.66,23.24
SERVO_PR-: length 17.8
  Bottom Layer w0.254: 33.66,20.7 27.5,14.54 27.5,5.5
SERVO_SVON: length 30.3
  Bottom Layer w0.254: 49.78,11.18 49.78,8.53 49.25,8 ; 44.93,3.68 20.57,3.68 18.75,5.5
Servo_SVON: length 6.1
  Bottom Layer w0.254: J2.2 44.93,3.68
STM_CAN_RX: length 26.2
  Bottom Layer w0.254: CN7.1 59.13,102.4 45.97,115.55 45.97,118.49 44.45,120.02 U4.4
STM_CAN_TX: length 24.6
  Bottom Layer w0.254: CN7.3 59.04,98.04 57.91,99.18 57.91,102.05 U4.1
STM_DIR: length 33.7
  Top Layer w0.254: CN10.23 57.86,44.45 52.33,44.45 U1.7
STM_ENCA: length 44.3
  Top Layer w0.254: 56.59,38.1 43,24.51 20.07,24.51 18.55,22.99
STM_ENCB: length 83.1
  Top Layer w0.254: 56.59,82.8 16.13,42.34 16.13,19.63 17.86,17.91 18.55,17.91
STM_PUL: length 75.3
  Bottom Layer w0.254: U1.1 35.94,12.82 35.94,55.12 50.67,69.85 57.86,69.85 CN10.3
STM_SVON_CTRL: length 56.6
  Bottom Layer w0.254: CN10.5 62.23,65.48 62.23,30.1 60.2,28.07 53.34,28.07 U3.1 48.51,23.11
SWITCH_NC-: length 1
  Bottom Layer w0.254: 52.75,10.75 52.32,11.18 52.32,11.56
Switch_NC-: length 8.3
  Bottom Layer w0.254: 52.75,10.75 J2.1 ; U3.16 52.32,11.56
VOUT: length 6.4
  Top Layer w0.6: U5.3 21.59,106.55 JP1.2
$4N50: length 2.7
  Bottom Layer w0.254: R1.2 53.4,117.47 56.01,117.47

## Copper pours and planes (outline as drawn; the poured copper is in the pictures)
GND on Top Layer: -9.27,143.51 84.33,143.51 84.33,-9.65 -9.27,-9.65
GND on Bottom Layer: -23.5,150.37 96.27,150.37 96.27,-19.56 -23.5,-19.56

Small or netless copper shapes (teardrops, artwork), in the pictures only: 4 on Top Layer

## Text on the board
Top Layer: Designed by Ko Kyu Beom | STEERING TEAM V1.0
